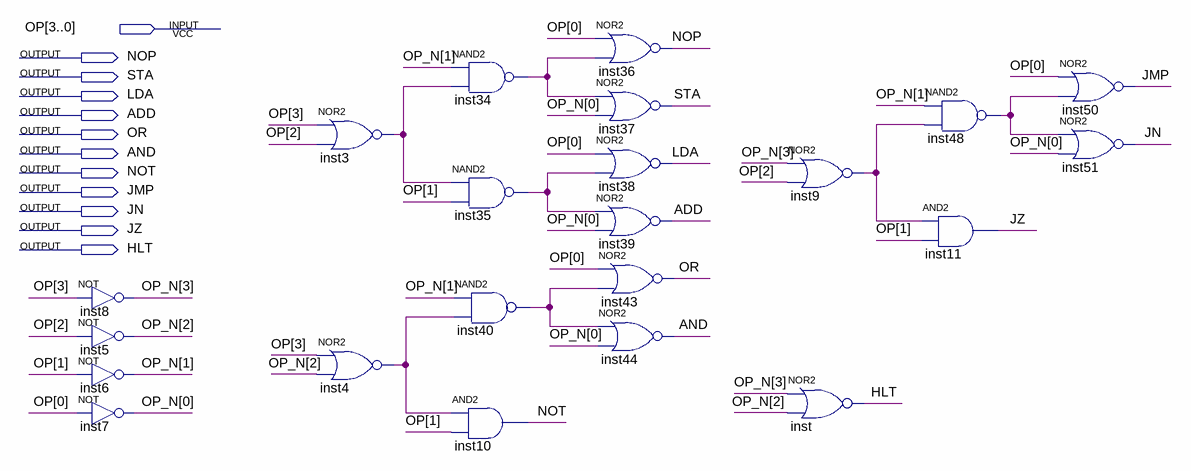
[diagram p0: schematic sheet]
// Quartus schematic OP_DECODER.bdf as structural Verilog: 22 symbols, 12 pins
module OP_DECODER (
  input  [3:0] OP,
  output NOP,
  output STA,
  output LDA,
  output ADD,
  output OR,
  output AND,
  output NOT,
  output JMP,
  output JN,
  output JZ,
  output HLT
);

  wire inst3_out, inst4_out, inst9_out, inst34_out, inst35_out, inst40_out, inst48_out;
  wire [3:0] OP_N;

  not inst8 (OP_N[3], OP[3]);
  not inst5 (OP_N[2], OP[2]);
  not inst6 (OP_N[1], OP[1]);
  not inst7 (OP_N[0], OP[0]);
  nor inst3 (inst3_out, OP[3], OP[2]);
  nor inst4 (inst4_out, OP[3], OP_N[2]);
  nand inst34 (inst34_out, OP_N[1], inst3_out);
  nand inst35 (inst35_out, inst3_out, OP[1]);
  nand inst40 (inst40_out, OP_N[1], inst4_out);
  and inst10 (NOT, inst4_out, OP[1]);
  nor inst36 (NOP, OP[0], inst34_out);
  nor inst37 (STA, inst34_out, OP_N[0]);
  nor inst38 (LDA, OP[0], inst35_out);
  nor inst39 (ADD, inst35_out, OP_N[0]);
  nor inst43 (OR, OP[0], inst40_out);
  nor inst44 (AND, inst40_out, OP_N[0]);
  nor inst9 (inst9_out, OP_N[3], OP[2]);
  nor inst (HLT, OP_N[3], OP_N[2]);
  nand inst48 (inst48_out, OP_N[1], inst9_out);
  and inst11 (JZ, inst9_out, OP[1]);
  nor inst50 (JMP, OP[0], inst48_out);
  nor inst51 (JN, inst48_out, OP_N[0]);
endmodule
